# Altium project PCB_Project_1.PrjPcb
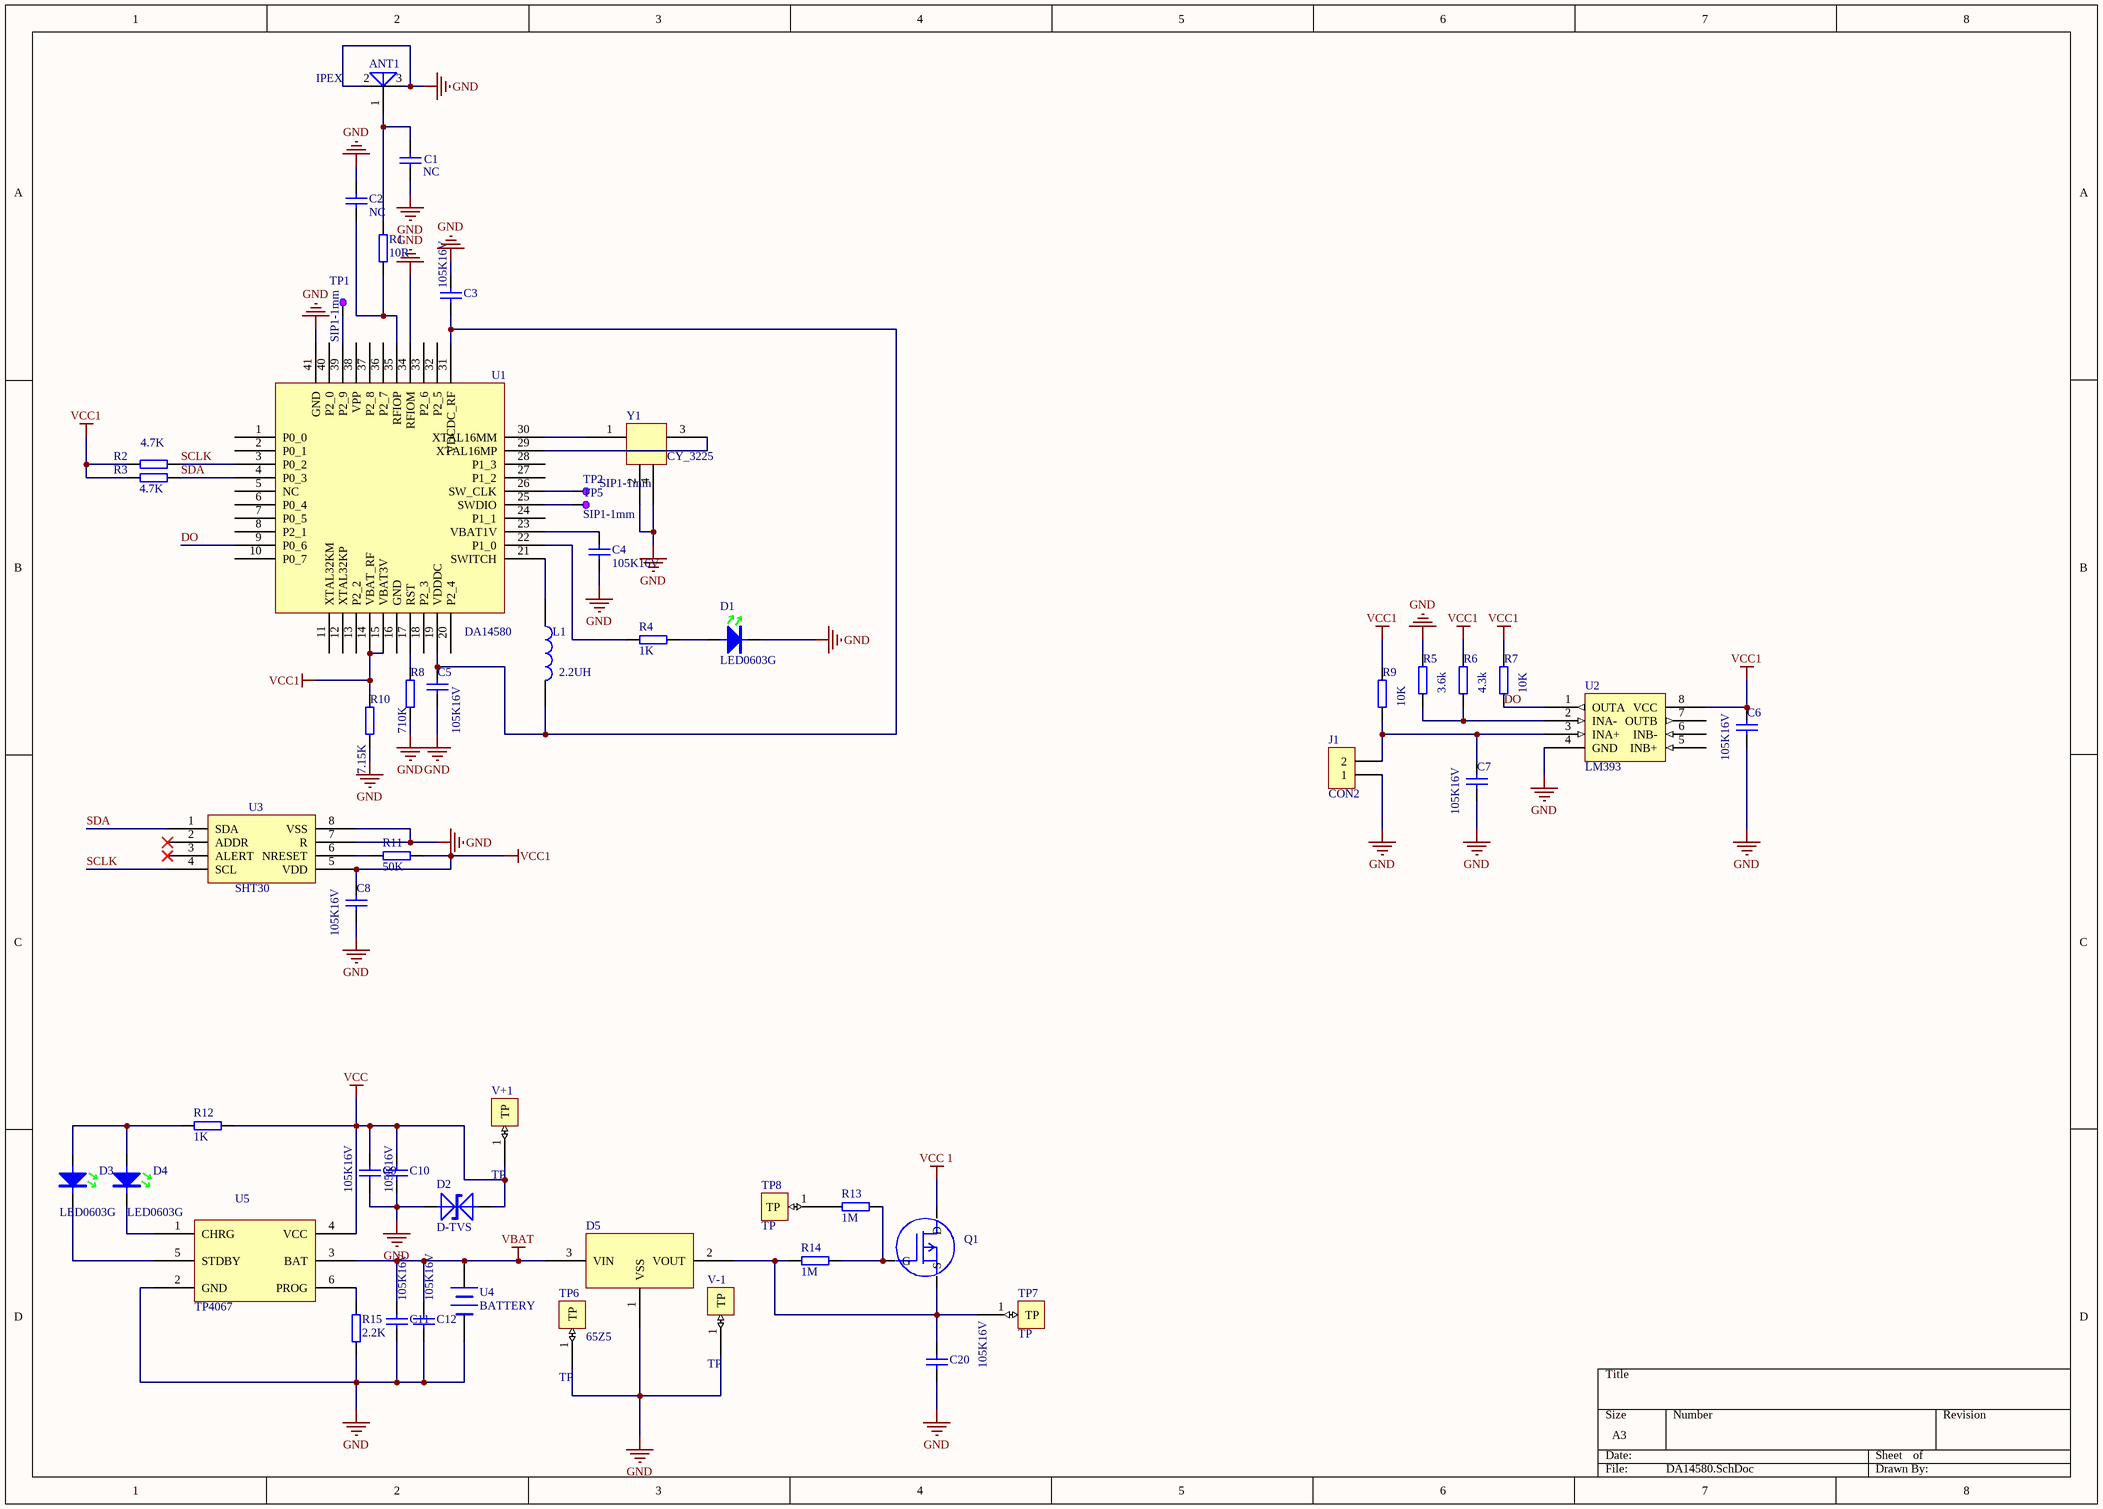
[diagram p0: DA14580.SchDoc]
1 sheet, 51 parts. Net scope: global (net labels, ports and power ports of the same name join across sheets).
Board file: DA14580.PcbDoc

## Sheet DA14580.SchDoc
size A3; PageSetup: Record=PageOptions|CenterHorizontal=True|CenterVertical=True|PrintScale=0.42|XCorrection=1.00|YCorrection=1.00|PrintKind=1|BorderSize=5000000|LeftOffset=0|BottomOffset=0|Orientation=2|PaperLength=1000|PaperWidth=1000|Scale=100|PaperSource=7|PrintQuality=-3|MediaType=1|DitherType=10|PrintScaleMode=1|PaperKind=5x8|PaperIndex=158

### Parts
ANT1  IPEX  [IFA]
C1  NC  [C0402]
C2  NC  [C0402]
C3  105K16V  [C0603]
C4  105K16V  [C0603]
C5  105K16V  [C0603]
C6  105K16V  [C0603]
C7  105K16V  [C0603]
C8  105K16V  [C0603]
C9  105K16V  [C0603]
C10  105K16V  [C0603]
C11  105K16V  [C0603]
C12  105K16V  [C0603]
C20  105K16V  [C0603]
D1  LED0603G  [HS_0603D]
D2  D-TVS  [0603C]
D3  LED0603G  [HS_0603D]
D4  LED0603G  [HS_0603D]
D5  65Z5
J1  CON2  [J-SH1.0-T-1-LT-2A]
L1  2.2UH  [0805]
Q1  AO3401 SOT-23  [SOT23-AO3401]  (value not drawn)
R1  10R  [R0402]
R2  4.7K  [R0402]
R3  4.7K  [R0402]
R4  1K  [R0402]
R5  3.6k  [R0402]
R6  4.3k  [R0402]
R7  10K  [R0402]
R8  710K  [R0402]
R9  10K  [R0402]
R10  7.15K  [R0402]
R11  50K  [R0402]
R12  1K  [R0402]
R13  1M  [R0402]
R14  1M  [R0402]
R15  2.2K  [R0402]
TP1  SIP1-1mm  [SIP - 1MM]
TP2  SIP1-1mm  [SIP - 1MM]
TP5  SIP1-1mm  [SIP - 1MM]
TP6  TP  [SIP-2MM]
TP7  TP  [SIP-2MM]
TP8  TP  [SIP-2MM]
U1  DA14580  [QFN40P500*500_HS-41N]
U2  LM393  [SO-8S]
U3  SHT30  [SHT30 DL7DV9]
U4  BATTERY  [BAT 4mm]
U5  TP4067  [SOT23-6]
V+1  TP  [SIP-2MM]
V-1  TP  [SIP-2MM]
Y1  CY_3225  [CY_3225]

### Nets
GND: ANT1.2 ANT1.3 C1.2 C2.1 C3.1 C4.2 C5.2 C6.2 C7.2 C8.2 C9.2 C10.2 C11.2 C12.2 C20.2 D1.2 D2.2 D5.1(VSS) J1.1 R5.2 R8.1 R10.1 R15.1 TP6.1(TP) U1.34(RFIOM) U1.41(GND) U2.4(GND) U3.7(R) U3.8(VSS) U4.2(-) U5.2(GND) V-1.1(TP) Y1.2 Y1.4
VBAT: C11.1 C12.1 D5.3(VIN) U4.1(+) U5.3(BAT)
VCC: C9.1 C10.1 D2.1 R12.2 U5.4(VCC) V+1.1(TP)
VCC1: C6.1 C8.1 R2.2 R3.2 R6.2 R7.2 R9.2 R10.2 R11.2 U1.14(VBAT_RF) U1.15(VBAT3V) U2.8(VCC) U3.5(VDD)
VCC 1: Q1.D
DO: R7.1 U1.9(P0_6) U2.1(OUTA)
SCLK: R2.1 U1.3(P0_2) U3.4(SCL)
SDA: R3.1 U1.4(P0_3) U3.1(SDA)
NetANT1_1: ANT1.1(W) C1.1 R1.1
NetC2_2: C2.2 R1.2 U1.35(RFIOP)
NetC3_2: C3.2 C5.1 L1.2 U1.19(VDDDC) U1.31(VDCDC_RF)
NetC4_1: C4.1 U1.23(VBAT1V)
NetC7_1: C7.1 J1.2 R9.1 U2.3(INA+)
NetC20_1: C20.1 D5.2(VOUT) Q1.S R14.1 TP7.1(TP)
NetD1_1: D1.1 R4.2
NetD3_1: D3.1 D4.1 R12.1
NetD3_2: D3.2 U5.5(STDBY)
NetD4_2: D4.2 U5.1(CHRG)
NetL1_1: L1.1 U1.21(SWITCH)
NetQ1_G: Q1.G R13.2 R14.2
NetR4_1: R4.1 U1.22(P1_0)
NetR5_1: R5.1 R6.1 U2.2(INA-)
NetR8_2: R8.2 U1.17(RST)
NetR11_1: R11.1 U3.6(NRESET)
NetR13_1: R13.1 TP8.1(TP)
NetR15_2: R15.2 U5.6(PROG)
NetTP1_1: TP1.1 U1.39(P2_9)
NetTP2_1: TP2.1 U1.26(SW_CLK)
NetTP5_1: TP5.1 U1.25(SWDIO)
NetU1_29: U1.29(XTAL16MP) Y1.3
NetU1_30: U1.30(XTAL16MM) Y1.1

Not connected (* = marked no-connect by the designer): U1 1(P0_0) 2(P0_1) 5(NC) 6(P0_4) 7(P0_5) 8(P2_1) 10(P0_7) 11(XTAL32KM) 12(XTAL32KP) 13(P2_2) 16(GND) 18(P2_3) 20(P2_4) 24(P1_1) 27(P1_2) 28(P1_3) 32(P2_5) 33(P2_6) 36(P2_7) 37(P2_8) 38(VPP) 40(P2_0); U2 5(INB+) 6(INB-) 7(OUTB); U3 2(ADDR)* 3(ALERT)*

### Library data of the parts
ANT1 = J-IPEX
C1 C2 = C0402X7R-101J10V: 贴片电容-陶瓷; 规格型号: 100pF±5%_10V_X7R_C0402; 生产商: 风华 三星; 供应商: *; 备注: *
C3-C12 C20 = C0603X7R-105K16V: 贴片电容-陶瓷; 规格型号: 1uF±10%_16V_X7R_C0603; 生产商: 风华 三星; 供应商: *; 备注: *
D1 D3 D4 = DLED-0603-G: 贴片二极管-LED; 规格型号: 0603-GREEN; 货品编码: 无样品无编码; 生产商: *; 供应商: *; 备注: *
J1 = CON2: Connector
L1 = INDUCTOR
Q1 = 2321 SOT-23: MOS管; 物料代码: 2.01.07.009
R1-R15 = R0402-1KF: 贴片电阻-通用; 生产商: 厚声 国巨; 规格型号: 1K±1%_1/10W_±200ppm_R0402; 备注: *; 供应商: *
TP1 TP2 TP5 = SIP1-2mm
U1 = DA14580: bluetooth